# EAGLE schematic R201X (EAGLE 6.6.0)
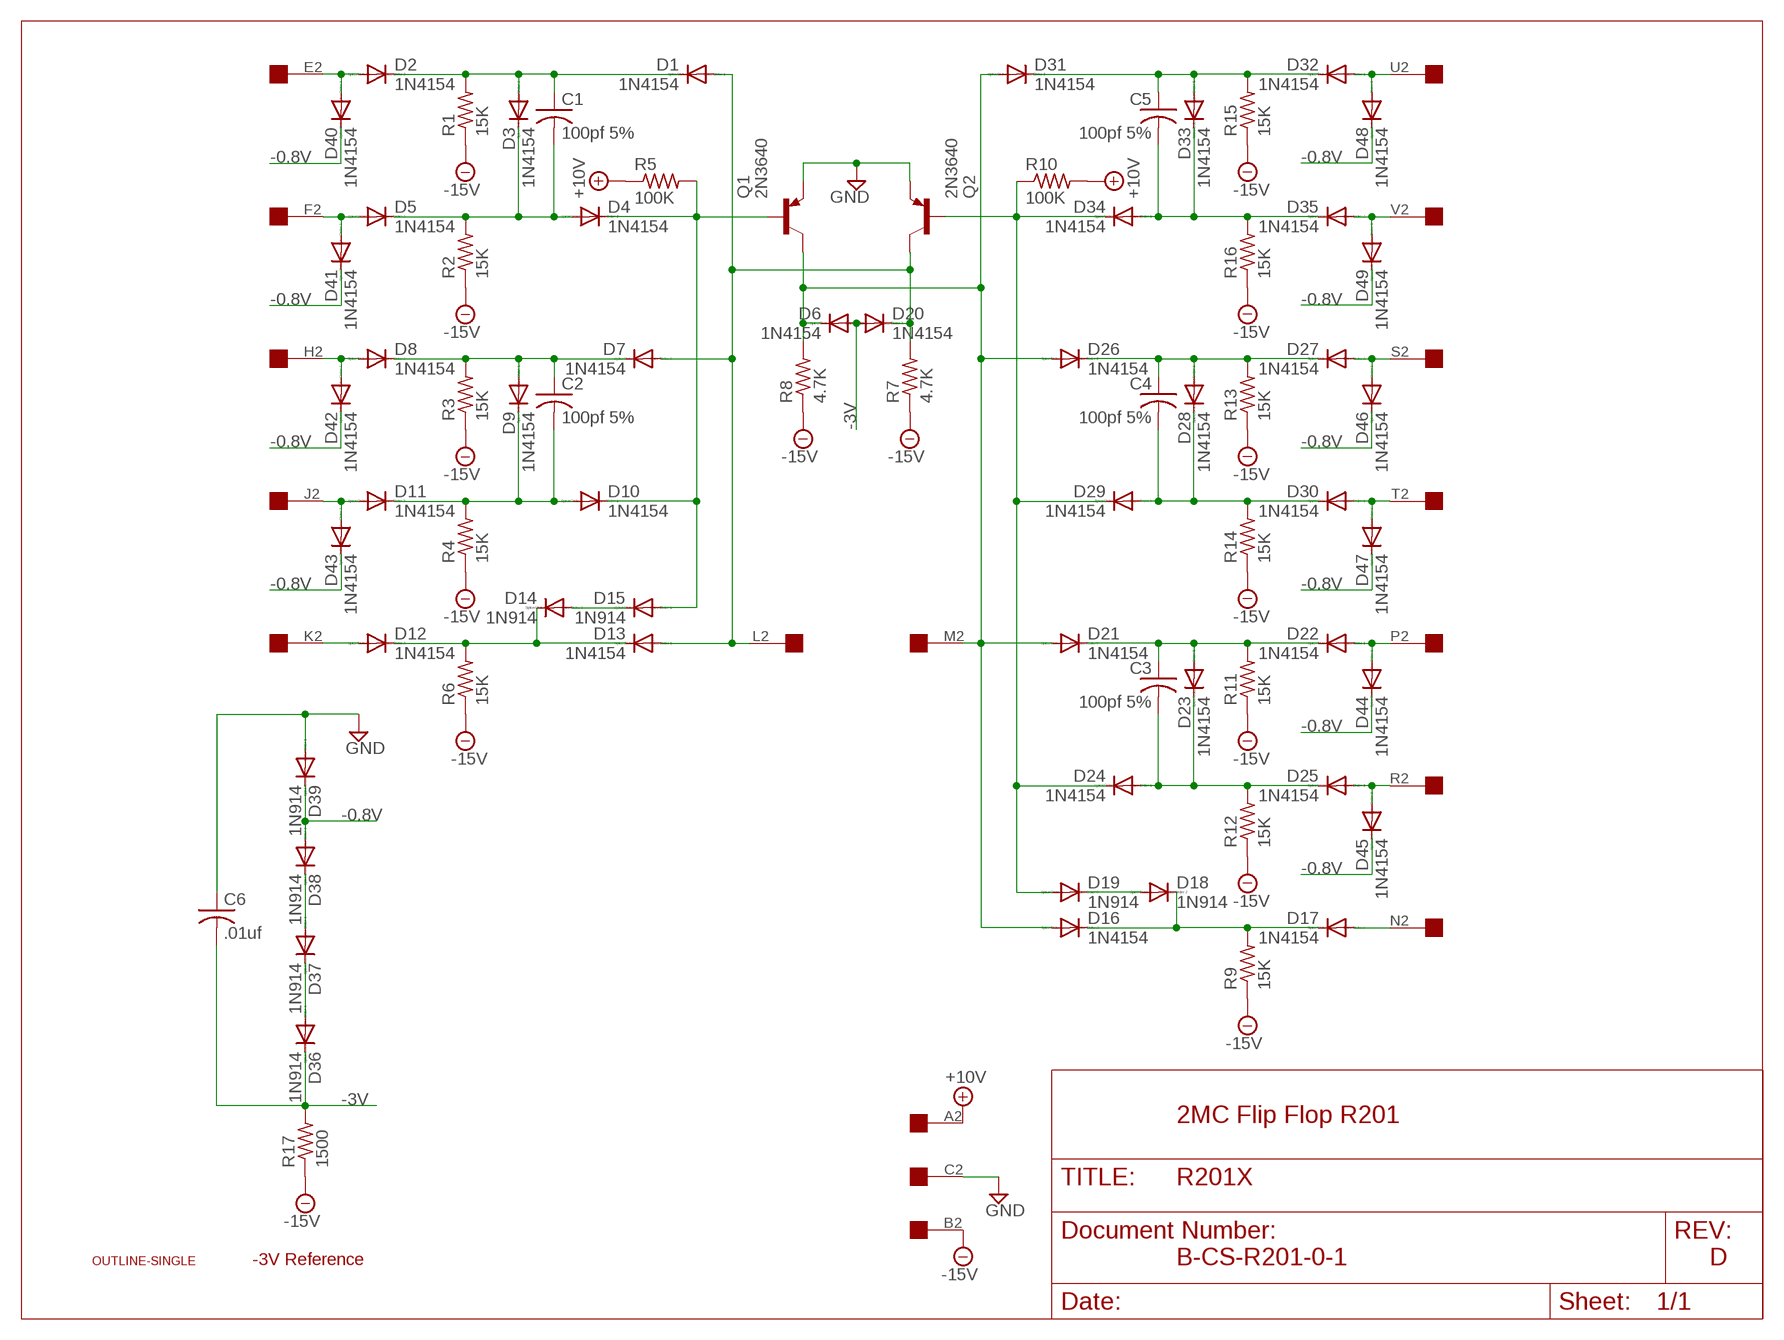
[diagram p0: schematic, sheet 1]

## Parts
C1  100pf 5%  C-US050-025X075  [C050-025X075]
C2  100pf 5%  C-US050-025X075  [C050-025X075]
C3  100pf 5%  C-US050-025X075  [C050-025X075]
C4  100pf 5%  C-US050-025X075  [C050-025X075]
C5  100pf 5%  C-US050-025X075  [C050-025X075]
C6  .01uf  C-US050-025X075  [C050-025X075]
D1  1N4154  1N4148DO35-10  [DO35-10]
D2  1N4154  1N4148DO35-10  [DO35-10]
D3  1N4154  1N4148DO35-10  [DO35-10]
D4  1N4154  1N4148DO35-10  [DO35-10]
D5  1N4154  1N4148DO35-10  [DO35-10]
D6  1N4154  1N4148DO35-10  [DO35-10]
D7  1N4154  1N4148DO35-10  [DO35-10]
D8  1N4154  1N4148DO35-10  [DO35-10]
D9  1N4154  1N4148DO35-10  [DO35-10]
D10  1N4154  1N4148DO35-10  [DO35-10]
D11  1N4154  1N4148DO35-10  [DO35-10]
D12  1N4154  1N4148DO35-10  [DO35-10]
D13  1N4154  1N4148DO35-10  [DO35-10]
D14  1N914  1N4148DO35-10  [DO35-10]
D15  1N914  1N4148DO35-10  [DO35-10]
D16  1N4154  1N4148DO35-10  [DO35-10]
D17  1N4154  1N4148DO35-10  [DO35-10]
D18  1N914  1N4148DO35-10  [DO35-10]
D19  1N914  1N4148DO35-10  [DO35-10]
D20  1N4154  1N4148DO35-10  [DO35-10]
D21  1N4154  1N4148DO35-10  [DO35-10]
D22  1N4154  1N4148DO35-10  [DO35-10]
D23  1N4154  1N4148DO35-10  [DO35-10]
D24  1N4154  1N4148DO35-10  [DO35-10]
D25  1N4154  1N4148DO35-10  [DO35-10]
D26  1N4154  1N4148DO35-10  [DO35-10]
D27  1N4154  1N4148DO35-10  [DO35-10]
D28  1N4154  1N4148DO35-10  [DO35-10]
D29  1N4154  1N4148DO35-10  [DO35-10]
D30  1N4154  1N4148DO35-10  [DO35-10]
D31  1N4154  1N4148DO35-10  [DO35-10]
D32  1N4154  1N4148DO35-10  [DO35-10]
D33  1N4154  1N4148DO35-10  [DO35-10]
D34  1N4154  1N4148DO35-10  [DO35-10]
D35  1N4154  1N4148DO35-10  [DO35-10]
D36  1N914  1N4148DO35-10  [DO35-10]
D37  1N914  1N4148DO35-10  [DO35-10]
D38  1N914  1N4148DO35-10  [DO35-10]
D39  1N914  1N4148DO35-10  [DO35-10]
D40  1N4154  1N4148DO35-10  [DO35-10]
D41  1N4154  1N4148DO35-10  [DO35-10]
D42  1N4154  1N4148DO35-10  [DO35-10]
D43  1N4154  1N4148DO35-10  [DO35-10]
D44  1N4154  1N4148DO35-10  [DO35-10]
D45  1N4154  1N4148DO35-10  [DO35-10]
D46  1N4154  1N4148DO35-10  [DO35-10]
D47  1N4154  1N4148DO35-10  [DO35-10]
D48  1N4154  1N4148DO35-10  [DO35-10]
D49  1N4154  1N4148DO35-10  [DO35-10]
Q1  2N3640  2N3637  [TO39]
Q2  2N3640  2N3637  [TO39]
R1  15K  R-US_0207/10  [0207/10]
R2  15K  R-US_0207/10  [0207/10]
R3  15K  R-US_0207/10  [0207/10]
R4  15K  R-US_0207/10  [0207/10]
R5  100K  R-US_0207/10  [0207/10]
R6  15K  R-US_0207/10  [0207/10]
R7  4.7K  R-US_0207/10  [0207/10]
R8  4.7K  R-US_0207/10  [0207/10]
R9  15K  R-US_0207/10  [0207/10]
R10  100K  R-US_0207/10  [0207/10]
R11  15K  R-US_0207/10  [0207/10]
R12  15K  R-US_0207/10  [0207/10]
R13  15K  R-US_0207/10  [0207/10]
R14  15K  R-US_0207/10  [0207/10]
R15  15K  R-US_0207/10  [0207/10]
R16  15K  R-US_0207/10  [0207/10]
R17  1500  R-US_0207/10  [0207/10]
U$1  OUTLINE-SINGLE  [SINGLE]
U$2  EDGE-1  [EDGE-CON1]

## Nets
+10V [Power]: R5.1 R10.2 U$2.A2
-0.8V [Power]: D38.A D39.C D40.C D41.C D42.C D43.C D44.C D45.C D46.C D47.C D48.C D49.C
-3V [Power]: C6.2 D6.A D20.A D36.C R17.2
-15V [Power]: R1.1 R2.1 R3.1 R4.1 R6.1 R7.1 R8.1 R9.1 R11.1 R12.1 R13.1 R14.1 R15.1 R16.1 R17.1 U$2.B2
GND [Power]: C6.1 D39.A Q1.1(E) Q2.1(E) U$2.C2
L: D1.A D7.A D13.A D20.C Q2.3(C) R7.2 U$2.L2
M: D6.C D16.A D21.A D26.A D31.A Q1.3(C) R8.2 U$2.M2
N$1: D5.A D41.A U$2.F2
N$2: C5.1 D31.C D32.C D33.A R15.2
N$3: C1.2 D3.C D4.A D5.C R2.2
N$4: C1.1 D1.C D2.C D3.A R1.2
N$5: D12.A U$2.K2
N$6: D19.A D24.C D29.C D34.C Q2.2(B) R10.1
N$7: D32.A D48.A U$2.U2
N$8: C5.2 D33.C D34.A D35.C R16.2
N$9: D17.A U$2.N2
N$10: D2.A D40.A U$2.E2
N$11: D35.A D49.A U$2.V2
N$12: D18.A D19.C
N$13: D37.A D38.C
N$14: D4.C D10.C D15.A Q1.2(B) R5.2
N$15: D14.A D15.C
N$16: D36.A D37.C
N$17: D22.A D44.A U$2.P2
N$18: D12.C D13.C D14.C R6.2
N$19: D8.A D42.A U$2.H2
N$20: D16.C D17.C D18.C R9.2
N$21: D11.A D43.A U$2.J2
N$22: C2.2 D9.C D10.A D11.C R4.2
N$23: D27.A D46.A U$2.S2
N$24: C2.1 D7.C D8.C D9.A R3.2
N$25: D30.A D47.A U$2.T2
N$26: C4.2 D28.C D29.A D30.C R14.2
N$27: C4.1 D26.C D27.C D28.A R13.2
N$28: D25.A D45.A U$2.R2
N$29: C3.2 D23.C D24.A D25.C R12.2
N$30: C3.1 D21.C D22.C D23.A R11.2
Unconnected: U$2.D2

## Notes on the sheet
- 2MC Flip Flop R201
- -3V Reference | B-CS-R201-0-1 | D

## Library data of the parts
C1-C6 = rcl:C-US: CAPACITOR, American symbol
D1-D49 = diode:1N4148: DIODE high speed (Philips)
Q1 Q2 = transistor-pnp:2N3637*: PNP Transistror
R1-R17 = rcl:R-US_: RESISTOR, American symbol
U$1 = dec-con:OUTLINE-*: Board outlines for DEC boards.
U$2 = dec-con:EDGE-1: Single-Sided DEC Edge Connector -- (side 2)

## Net classes
1 Power: width 0.813 mm